# EAGLE schematic voicemodulator_schm (EAGLE 9.2.1)
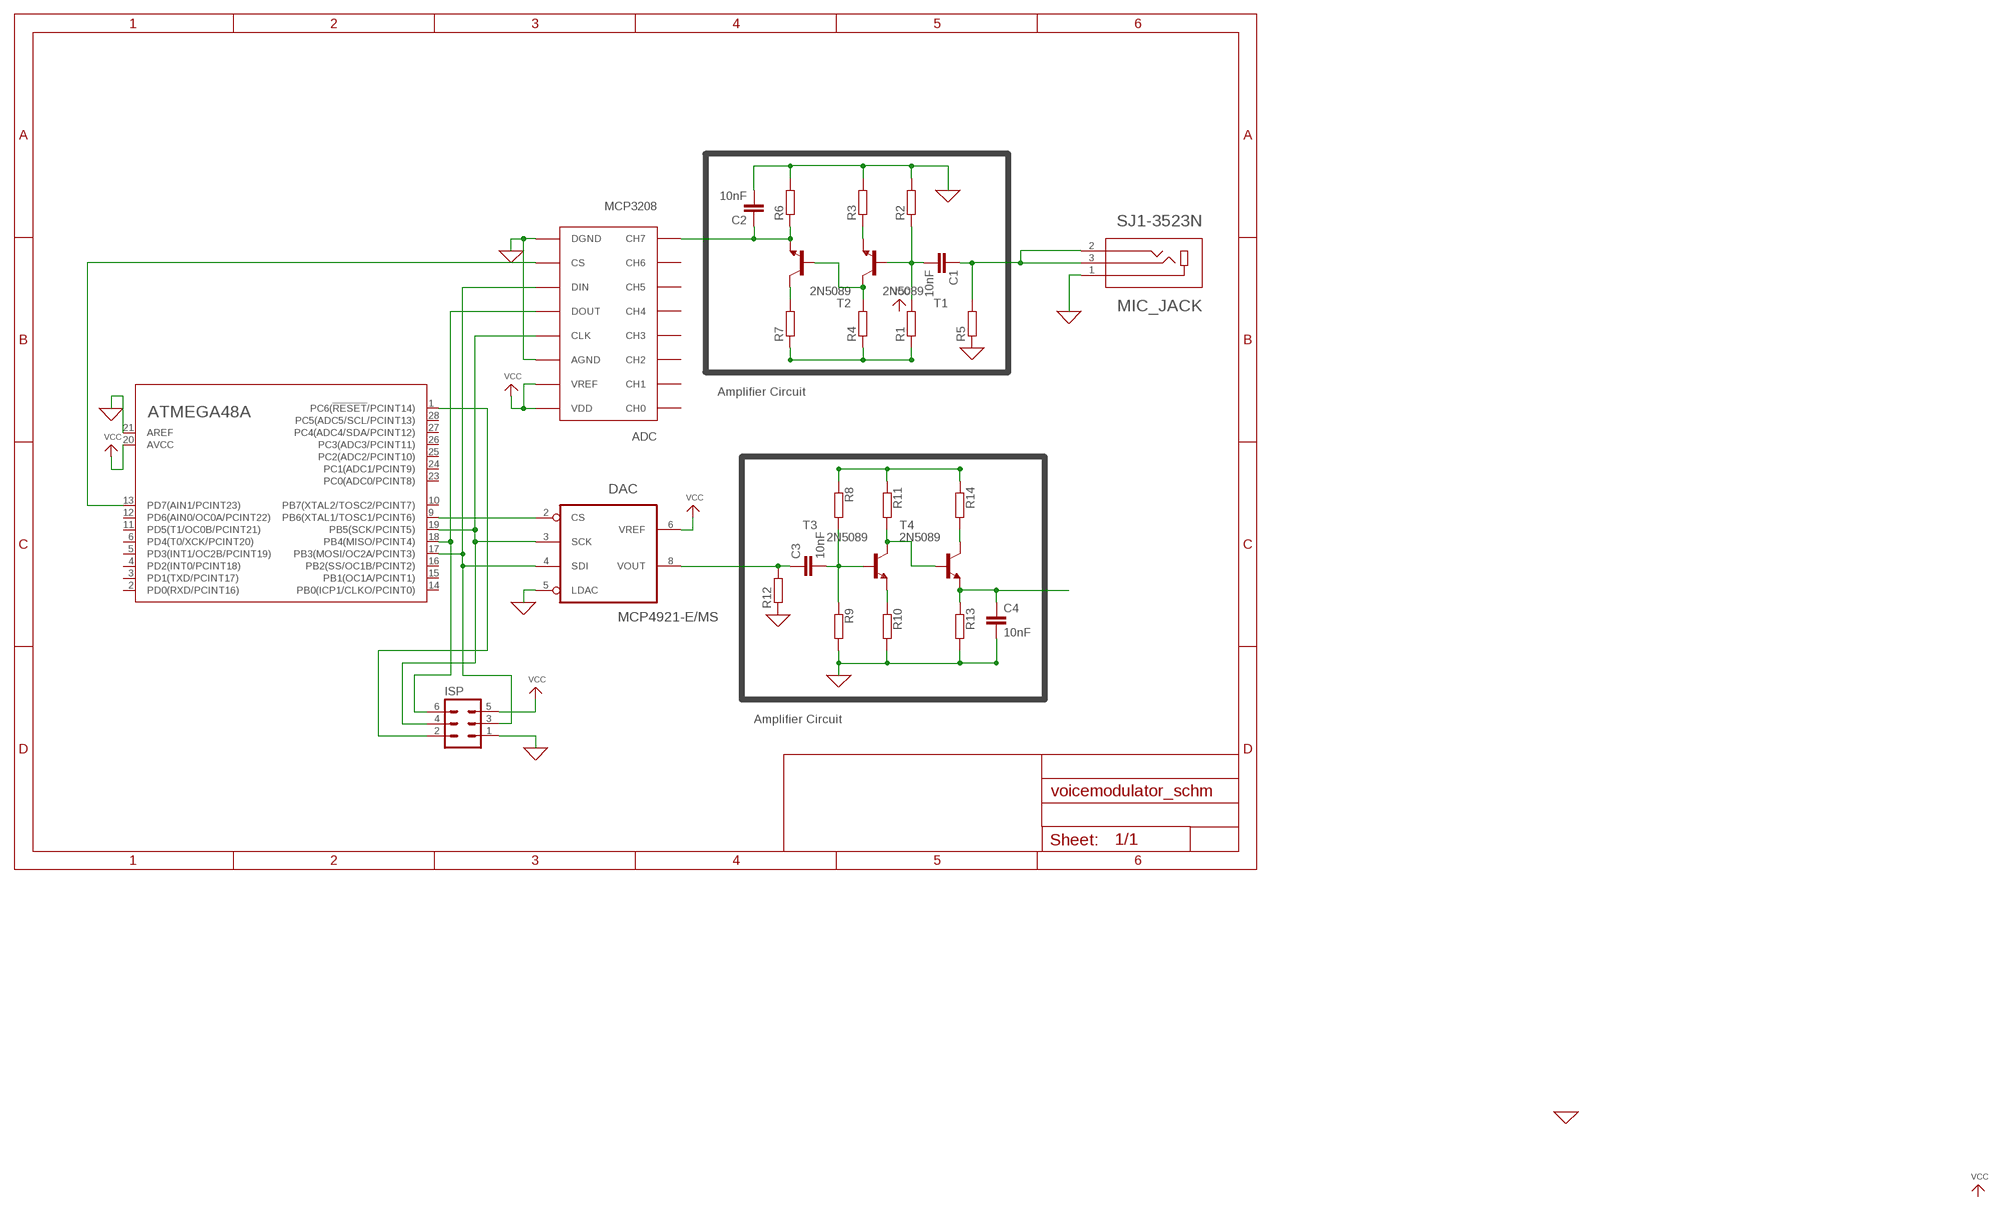
[diagram p0: schematic, sheet 1]

## Parts
ADC  MCP3208  [DIL16]
ATMEGA48A  ATMEGA48/88/168/328-PU(DIP28)PU  [DIL28]
C1  10nF  10NF-0603-50V-10%  [0603]
C2  10nF  10NF-0603-50V-10%  [0603]
C3  10nF  10NF-0603-50V-10%  [0603]
C4  10nF  10NF-0603-50V-10%  [0603]
DAC  MCP4921-E/MS  [MSOP-8]
ISP  MA03-2  [MA03-2]
MIC_JACK  SJ1-3523N  [CUI_SJ1-3523N]
R1  SMR-WAV  [SMS-WAV]
R2  SMR-WAV  [SMS-WAV]
R3  SMR-WAV  [SMS-WAV]
R4  SMR-WAV  [SMS-WAV]
R5  SMR-WAV  [SMS-WAV]
R6  SMR-WAV  [SMS-WAV]
R7  SMR-WAV  [SMS-WAV]
R8  SMR-WAV  [SMS-WAV]
R9  SMR-WAV  [SMS-WAV]
R10  SMR-WAV  [SMS-WAV]
R11  SMR-WAV  [SMS-WAV]
R12  SMR-WAV  [SMS-WAV]
R13  SMR-WAV  [SMS-WAV]
R14  SMR-WAV  [SMS-WAV]
T1  2N5089  [TO92]
T2  2N5089  [TO92]
T3  2N5089  [TO92]
T4  2N5089  [TO92]

## Nets
0: ADC.AGND ADC.DGND ATMEGA48A.21(AREF) C2.2 C4.2 DAC.5(LDAC) ISP.1 MIC_JACK.1 R2.1 R3.1 R5.2 R6.1 R9.1 R10.1 R12.2 R13.1 ; supply symbol labelled GND
N$1: C1.1 MIC_JACK.2 MIC_JACK.3 R5.1
N$2: ADC.DOUT ATMEGA48A.18(PB4(MISO/PCINT4)) ISP.6
N$3: C1.2 R1.1 R2.2 T1.2(B)
N$4: C3.1 DAC.8(VOUT) R12.1
N$5: ADC.CH7 C2.1 R6.2 T2.3(E)
N$6: R7.1 T2.1(C)
N$7: R3.2 T1.3(E)
N$8: R4.1 T1.1(C) T2.2(B)
N$9: C3.2 R8.1 R9.2 T3.2(B)
N$10: R1.2 R4.2 R7.2
N$11: C4.1 R13.2 T4.3(E)
N$12: R14.1 T4.1(C)
N$13: R10.2 T3.3(E)
N$14: R11.1 T3.1(C) T4.2(B)
N$15: R8.2 R11.2 R14.2
N$16: ADC.DIN ATMEGA48A.17(PB3(MOSI/OC2A/PCINT3)) DAC.4(SDI) ISP.3
N$17: ADC.CLK ATMEGA48A.19(PB5(SCK/PCINT5)) DAC.3(SCK) ISP.4
N$19: ADC.CS ATMEGA48A.13(PD7(AIN1/PCINT23))
N$20: ATMEGA48A.9(PB6(XTAL1/TOSC1/PCINT6)) DAC.2(CS)
N$22: ATMEGA48A.1(PC6(!RESET!/PCINT14)) ISP.2
VCC: ADC.VDD ADC.VREF ATMEGA48A.20(AVCC) DAC.6(VREF) ISP.5
Unconnected: ADC.CH0 ADC.CH1 ADC.CH2 ADC.CH3 ADC.CH4 ADC.CH5 ADC.CH6 ATMEGA48A.2(PD0(RXD/PCINT16)) ATMEGA48A.3(PD1(TXD/PCINT17)) ATMEGA48A.4(PD2(INT0/PCINT18)) ATMEGA48A.5(PD3(INT1/OC2B/PCINT19)) ATMEGA48A.6(PD4(T0/XCK/PCINT20)) ATMEGA48A.10(PB7(XTAL2/TOSC2/PCINT7)) ATMEGA48A.11(PD5(T1/OC0B/PCINT21)) ATMEGA48A.12(PD6(AIN0/OC0A/PCINT22)) ATMEGA48A.14(PB0(ICP1/CLKO/PCINT0)) ATMEGA48A.15(PB1(OC1A/PCINT1)) ATMEGA48A.16(PB2(SS/OC1B/PCINT2)) ATMEGA48A.23(PC0(ADC0/PCINT8)) ATMEGA48A.24(PC1(ADC1/PCINT9)) ATMEGA48A.25(PC2(ADC2/PCINT10)) ATMEGA48A.26(PC3(ADC3/PCINT11)) ATMEGA48A.27(PC4(ADC4/SDA/PCINT12)) ATMEGA48A.28(PC5(ADC5/SCL/PCINT13))

## Notes on the sheet
- Amplifier Circuit
- Amplifier Circuit

## Power pins joined to a net without a drawn wire
GND: ATMEGA48A.8(GND) ATMEGA48A.22(GND) DAC.7(GND)
UCC: ATMEGA48A.7(UCC)
VCC: DAC.1(VCC)

## Library data of the parts
ADC = mcp3208:MCP3208
ATMEGA48A = atmel_tiny24-44-84tiny48-88mega48-88-168-328:ATMEGA48/88/168/328-PU(DIP28)
C1-C4 = SparkFun-Capacitors:10NF: 0.01uF/10nF/10,000pF ceramic capacitors A capacitor is a passive two-terminal electrical component used to store electrical energy temporarily in an electric field. CAP-09321; PROD_ID: CAP-00867
DAC = dac:MCP49*1: Digital-to-Analog Converter
ISP = con-lstb:MA03-2: PIN HEADER; OC_FARNELL: unknown; OC_NEWARK: unknown
MIC_JACK = SJ1-3523N:SJ1-3523N: 3.5 mm Right-Angle Stereo Jack, 3 Pin PCB Mount, Non-Threaded; MANUFACTURER: CUI; PARTREV: 1.02; STANDARD: Manufacturer recommendation
R1-R14 = resistor-shunt:SMR-WAV: SMD SHUNT RESISTOR; OC_FARNELL: unknown; OC_NEWARK: unknown
T1-T4 = transistor:2N5089: NPN TRANSISTOR